# Altium schematic sheet GZ7_1_x-ULN2003.SchDoc: GZ8-4-0
size B; SheetNumber: 8; SheetTotal: 10
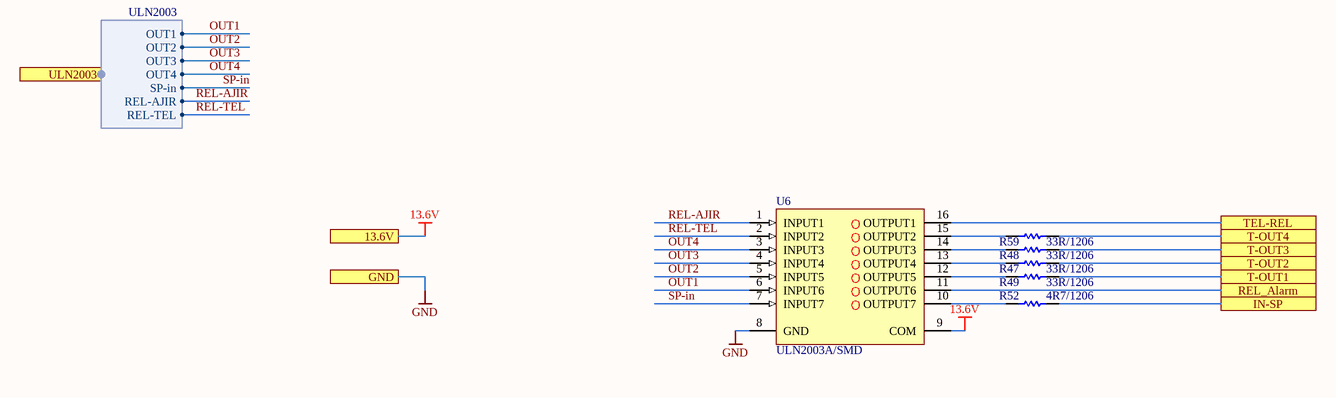
[diagram p0: GZ7_1_x-ULN2003.SchDoc]

## Parts
R47  33R/1206  [my1206]
R48  33R/1206  [MY1206]
R49  33R/1206  [my1206]
R52  4R7/1206  [RES-(1/2)DS]
R59  33R/1206  [MY1206]
U6  ULN2003A/SMD  [SO-16]

## Ports
13.6V, GND, IN-SP, REL_Alarm, T-OUT1, T-OUT2, T-OUT3, T-OUT4, TEL-REL, ULN2003 (harness ULN2003)

## Harnesses
ULN2003: OUT1, OUT2, OUT3, SP-in, REL-AJIR, OUT4, REL-TEL

## Nets
13.6V: U6.9(COM) ; port 13.6V
GND: U6.8(GND) ; port GND
IN-SP: R52.2 ; port IN-SP
OUT1: U6.6(INPUT6) ; port ULN2003.OUT1
OUT2: U6.5(INPUT5) ; port ULN2003.OUT2
OUT3: U6.4(INPUT4) ; port ULN2003.OUT3
OUT4: U6.3(INPUT3) ; port ULN2003.OUT4
REL-AJIR: U6.1(INPUT1) ; port ULN2003.REL-AJIR
REL-TEL: U6.2(INPUT2) ; port ULN2003.REL-TEL
REL_Alarm: U6.11(OUTPUT6) ; port REL_Alarm
SP-in: U6.7(INPUT7) ; port ULN2003.SP-in
T-OUT1: R49.2 ; port T-OUT1
T-OUT2: R47.2 ; port T-OUT2
T-OUT3: R48.2 ; port T-OUT3
T-OUT4: R59.2 ; port T-OUT4
TEL-REL: U6.16(OUTPUT1) ; port TEL-REL
NetR47_1: R47.1 U6.13(OUTPUT4)
NetR48_1: R48.1 U6.14(OUTPUT3)
NetR49_1: R49.1 U6.12(OUTPUT5)
NetR52_1: R52.1 U6.10(OUTPUT7)
NetR59_1: R59.1 U6.15(OUTPUT2)

## Notes on the sheet
- Serial Number:
- Altium Vip Course
- Title:
- Revision:
- Approved By:
- Date:
- Sheet       of
- SheetTotal
- Sheet Size: B
- File:

## Library data of the parts
R47-R49 R59 = RES 1206 0.25W: RES 1206; Designer: Abbas Basereh; Desc.: RES SMD 1206; Data: 16-12-2016
R52 = RES Axial 0.5W: RES Axial 1/4W; Designer: Abbas Basereh; Desc.: RES Axial 0.5W; Data: 4-1-2017
U6 = ULN2003A: ComponentLink1Description: Datasheet; ComponentLink2URL: http://www.st.com